# EAGLE design tick-controller-mk-3 (EAGLE 6.5.0)
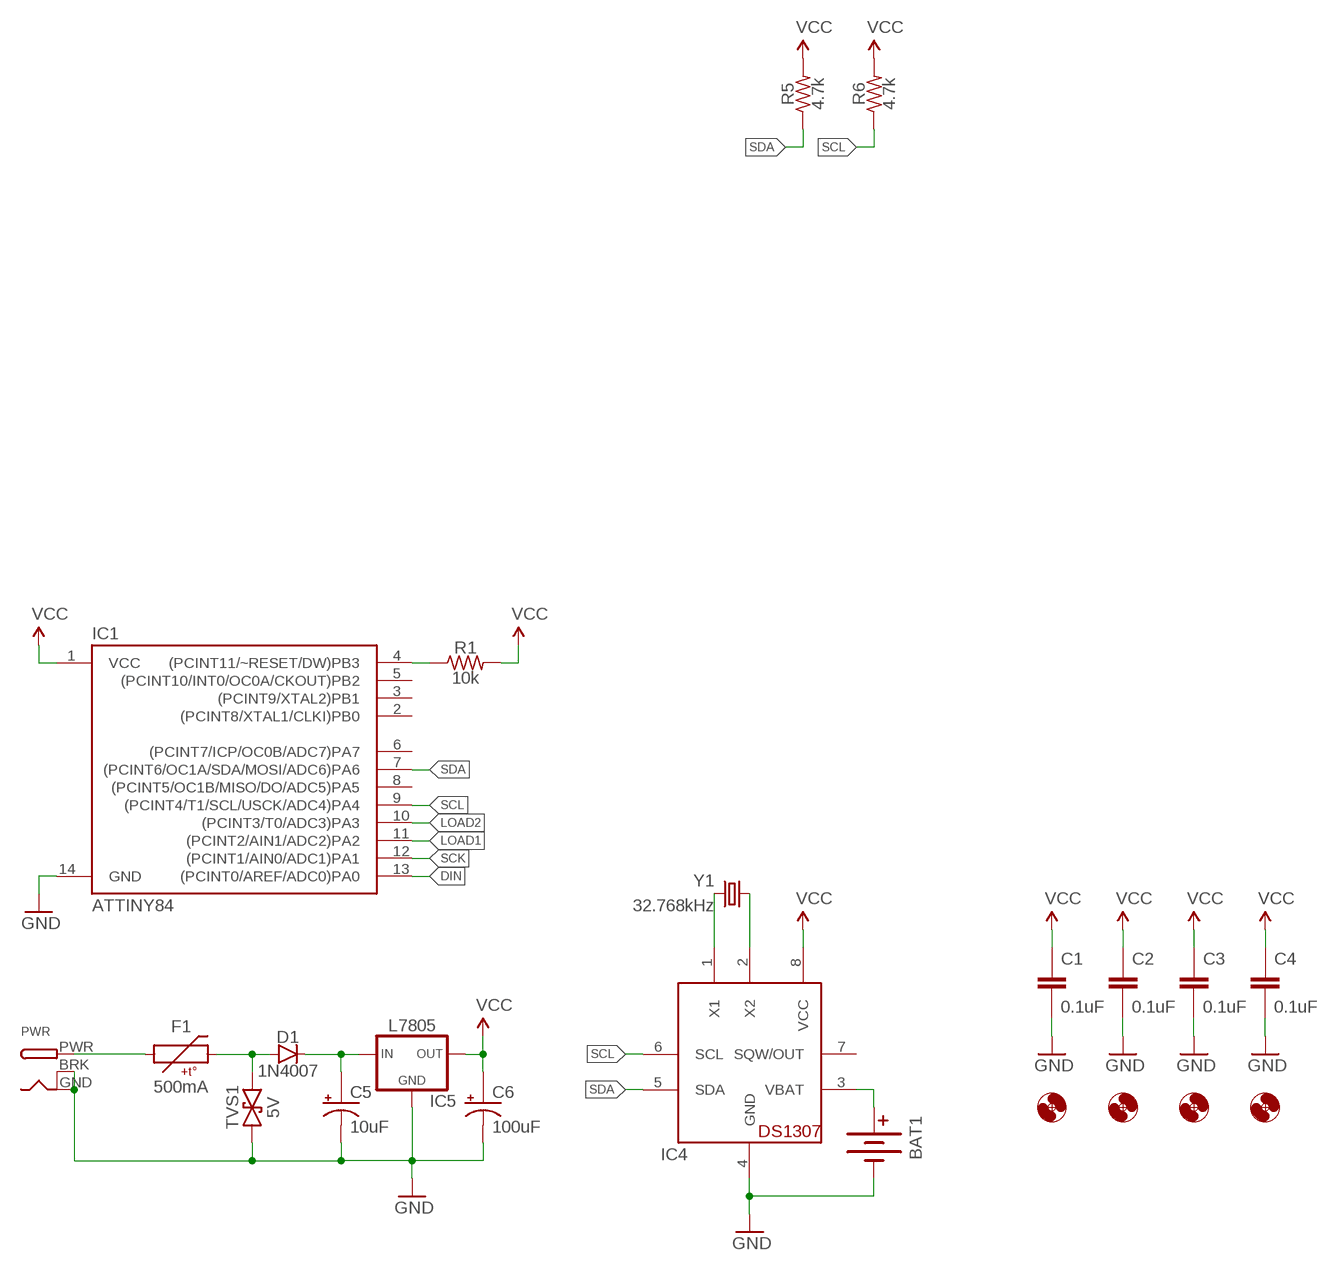
[diagram p0: schematic, sheet 1]

## Parts
BAT1  BATTERY20SMD  [BATTCON_20MM]
C1  0.1uF  CAPACITOR-CERAMIC025-024X044  [C025-024X044]
C2  0.1uF  CAPACITOR-CERAMIC025-024X044  [C025-024X044]
C3  0.1uF  CAPACITOR-CERAMIC025-024X044  [C025-024X044]
C4  0.1uF  CAPACITOR-CERAMIC025-024X044  [C025-024X044]
C5  10uF  CAPACITOR-POLARIZEDE2-5  [E2-5]
C6  100uF  CAPACITOR-POLARIZEDE2-5  [E2-5]
D1  1N4007  DIODEPTH-10.68MM  [DIODE-10.16MM]
F1  500mA  PTCPTH-5.08MM  [PTC-PTH-5.08MM]
H1  HOLE#2  [HOLE-#2]
H2  HOLE#2  [HOLE-#2]
H3  HOLE#2  [HOLE-#2]
H4  HOLE#2  [HOLE-#2]
IC1  ATTINY84  ATTINY84ATTINY84-20PU  [DIL14]
IC4  DS1307  [DIL08]
IC5  L7805  V_REG_78XXTO-92-INLINE  [TO-92-AMMO]
PWR  DCBARRELPTH  [DCJACK_2MM_PTH]
R1  10k  RESISTORPTH-AXIAL-5.08MM  [RESISTOR-AXIAL-PTH-5.08MM]
R5  4.7k  RESISTORPTH-AXIAL-5.08MM  [RESISTOR-AXIAL-PTH-5.08MM]
R6  4.7k  RESISTORPTH-AXIAL-5.08MM  [RESISTOR-AXIAL-PTH-5.08MM]
TVS1  5V  TVSDO-41-10.16MM  [DO-41-TVS-BI-10.16MM]
Y1  32.768kHz  CRYSTALTC26H  [TC26H]

## Nets
DIN: IC1.13((PCINT0/AREF/ADC0)PA0)
GND: BAT1.2(-) C1.2 C2.2 C3.2 C4.2 C5.- C6.- IC1.14(GND) IC4.4(GND) IC5.2(GND) PWR.BRK PWR.GND TVS1.P$1
LOAD1: IC1.11((PCINT2/AIN1/ADC2)PA2)
LOAD2: IC1.10((PCINT3/T0/ADC3)PA3)
N$1: IC1.4((PCINT11/~RESET/DW)PB3) R1.P$1
N$3: IC4.1(X1) Y1.2
N$4: BAT1.1(+) BAT1.3(+) IC4.3(VBAT)
N$5: IC4.2(X2) Y1.1
N$6: C5.+ D1.C IC5.1(IN)
N$7: F1.P$1 PWR.PWR
N$8: D1.A F1.P$2 TVS1.P$2
SCK: IC1.12((PCINT1/AIN0/ADC1)PA1)
SCL: IC1.9((PCINT4/T1/SCL/USCK/ADC4)PA4) IC4.6(SCL) R6.P$1
SDA: IC1.7((PCINT6/OC1A/SDA/MOSI/ADC6)PA6) IC4.5(SDA) R5.P$1
VCC: C1.1 C2.1 C3.1 C4.1 C6.+ IC1.1(VCC) IC4.8(VCC) IC5.3(OUT) R1.P$2 R5.P$2 R6.P$2
Unconnected: IC1.2((PCINT8/XTAL1/CLKI)PB0) IC1.3((PCINT9/XTAL2)PB1) IC1.5((PCINT10/INT0/OC0A/CKOUT)PB2) IC1.6((PCINT7/ICP/OC0B/ADC7)PA7) IC1.8((PCINT5/OC1B/MISO/DO/ADC5)PA5) IC4.7(SQW/OUT)

## Library data of the parts
BAT1 = A_butts:BATTERY: Battery Holders Various common sizes : AA, AAA, 20mm coin cell and 12mm coin cell. 20MM_4LEGS, BATT-10373
C1-C4 = A_butts:CAPACITOR-CERAMIC: CAPACITOR, European symbol
C5 C6 = A_butts:CAPACITOR-POLARIZED: POLARIZED CAPACITOR, American symbol
D1 = A_butts:DIODE: Diode These are standard reverse protection diodes and small signal diodes. SMA package can handle up to about 1A. SOD-323 can handle about 200mA. What the SOD-323 package when ordering, there are some mfgs out there that are 5-pin packages.
F1 = A_butts:PTC: Resettable Fuse PTC Resettable Fuse. Spark Fun Electronics SKU : COM-08357
H1-H4 = A_butts:HOLE: MOUNTING HOLE with drill center marker
IC1 = A_butts:ATTINY84: Atmel 14-pin 2/4/8kB flash uC
IC4 = A_butts:DS1307: DS1307 Real time clock (RTC) with battery backup ability. Talk to it via i2c
IC5 = A_butts:V_REG_78XX: Voltage Regulator Standard 7805 5V regulator. IGO (Input Ground Output). Spark Fun Electronics SKU : COM-00107
PWR = A_butts:DCBARREL: 2.0mm DC Barrel Jack DCJACK_2MM_PTH - Through Hole Jack (4UConnector: 05537)
R1 R5 R6 = A_butts:RESISTOR: RESISTOR, American symbol
TVS1 = A_butts:TVS: Transient voltage suppressor- prevents ESD on inputs. Ignore package description- MBRA140 is NOT this type of part!!!
Y1 = A_butts:CRYSTAL: Various standard crystals. Proven footprints. Spark Fun Electronics SKU : COM-00534

## Board
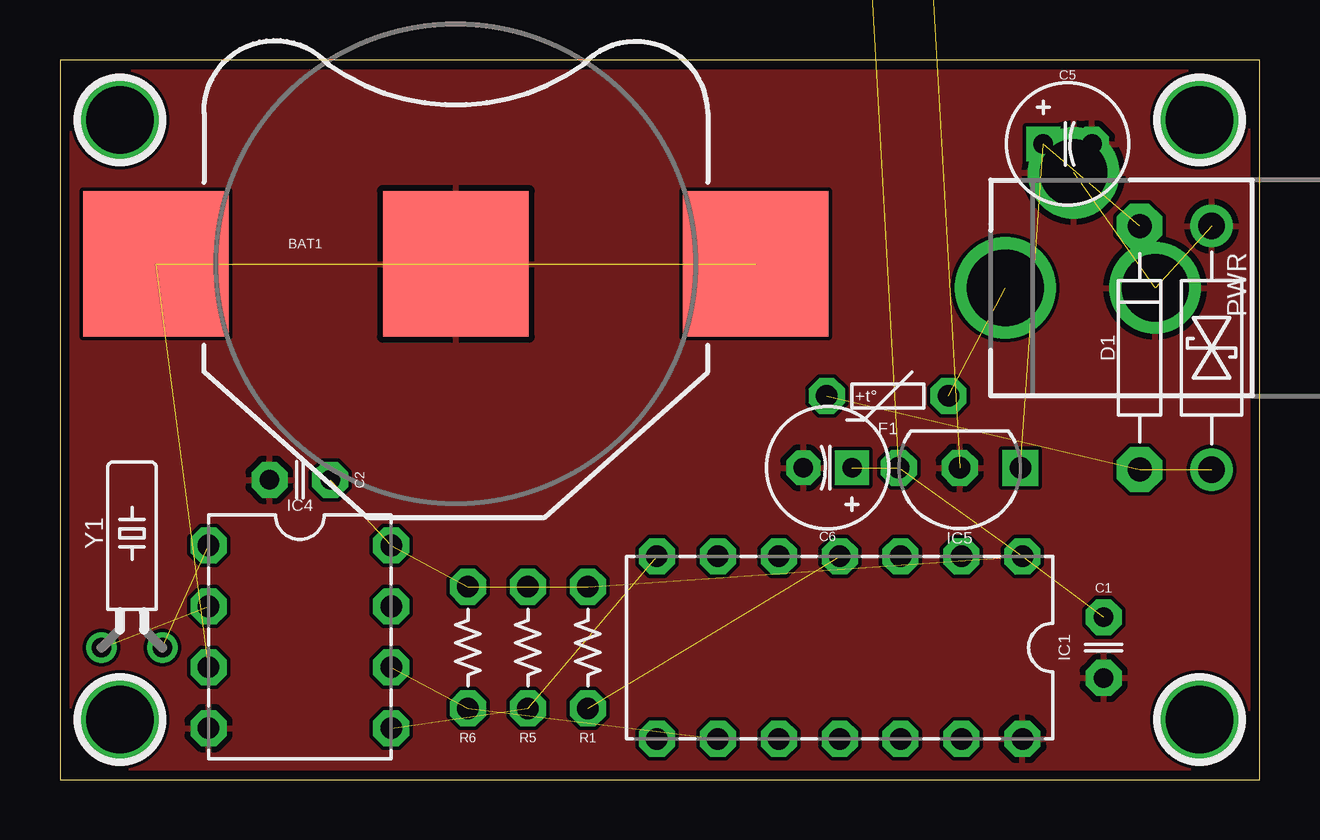
[diagram p1: board, top side]
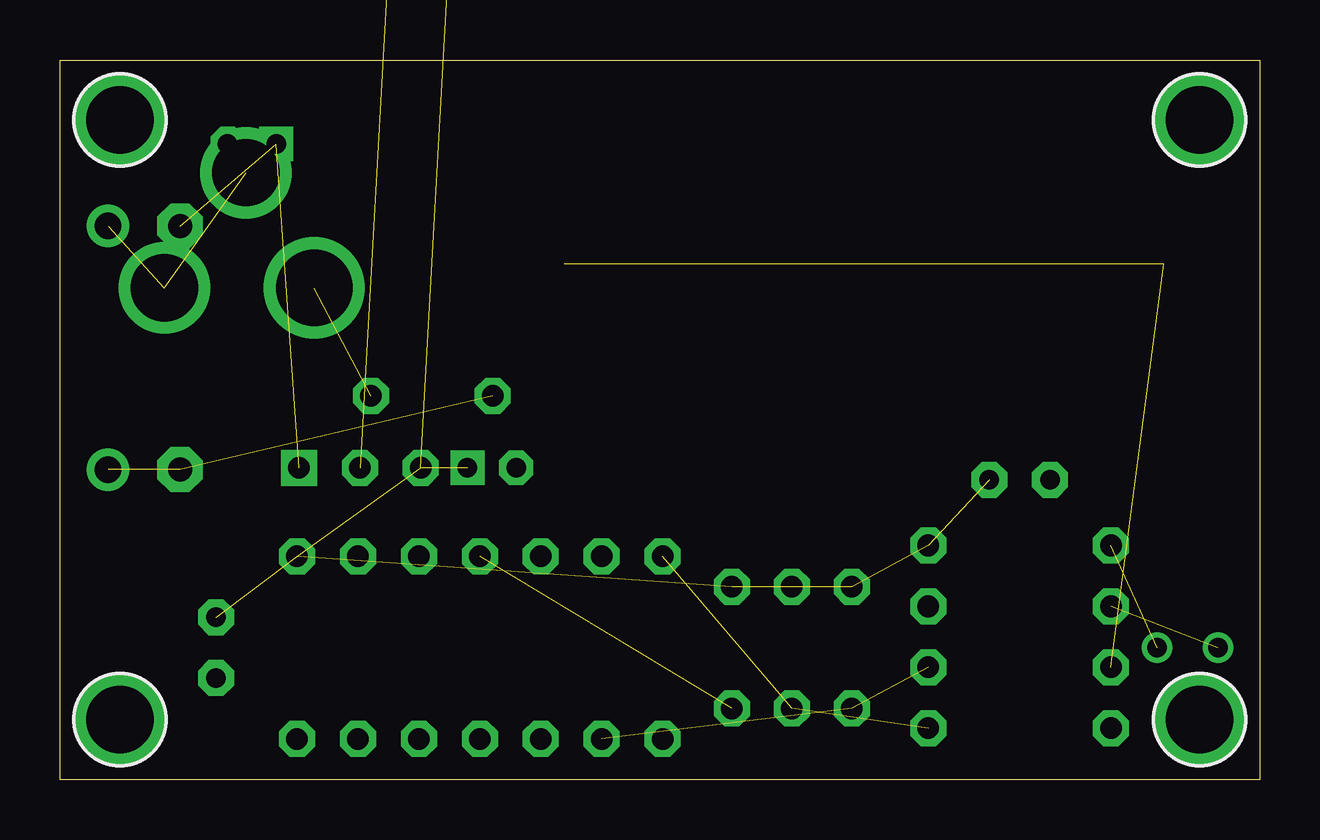
[diagram p2: board, bottom side, seen from below]

Size 50 x 30 mm. Coordinates in mm from the lower left corner, seen from the top.
Outline: 0,0 50,0 50,30 0,30 0,0
Copper layers (1*16): Top 0.0356mm / dielectric 1.5011mm / Bottom 0.0356mm
Design rules "LaenPCBOrder2": minimum track width 6mil, minimum drill 13mil, track to track 6mil, track to pad 6mil, pad to pad 6mil, via to via 6mil, smd to smd 6mil, copper to edge 15mil, drill to drill 6mil, minimum pad ring 7mil, minimum via ring 7mil, stop-mask expansion 3mil, vias tented up to drill 20mil, thermal gap 10mil

### Footprints (pad centres in the part's own frame; a part is rotated, then mirrored left to right if it is on the bottom)
BATTCON_20MM = smd 6.07 x 6.07: 1 -12.5,0; 2 0,0; 3 12.5,0
C025-024X044 = drill 0.813 pad 1.5 octagon: 1 -1.27,0; 2 1.27,0
E2-5 = drill 0.813 pad 1.422 square: + -1.016,0 | drill 0.813 pad 1.422 octagon: - 1.016,0
DIODE-10.16MM = drill 1 pad 1.88 octagon: A -5.08,0; C 5.08,0
PTC-PTH-5.08MM = drill 0.9 pad 1.5 octagon: P$1 -2.54,0; P$2 2.54,0
HOLE-#2 = drill 2.8 pad 3.81: P$1 0,0
DIL14 = drill 0.9 pad 1.5 octagon: 1 -7.62,-3.81; 2 -5.08,-3.81; 3 -2.54,-3.81; 4 0,-3.81; 5 2.54,-3.81; 6 5.08,-3.81; 7 7.62,-3.81; 8 7.62,3.81; 9 5.08,3.81; 10 2.54,3.81; 11 0,3.81; 12 -2.54,3.81; 13 -5.08,3.81; 14 -7.62,3.81
DIL08 = drill 0.9 pad 1.5 octagon: 1 -3.81,-3.81; 2 -1.27,-3.81; 3 1.27,-3.81; 4 3.81,-3.81; 5 3.81,3.81; 6 1.27,3.81; 7 -1.27,3.81; 8 -3.81,3.81
TO-92-AMMO = drill 0.9 pad 1.5 square: 1 -2.54,0 | drill 0.9 pad 1.5 octagon: 2 0,0; 3 2.54,0
DCJACK_2MM_PTH = drill 2.8: BRK 4.8,10.75; GND 0,7.35 | drill 3.2: PWR 0,13.6
RESISTOR-AXIAL-PTH-5.08MM = drill 0.9 pad 1.5 octagon: P$1 -2.54,0; P$2 2.54,0
DO-41-TVS-BI-10.16MM = drill 1.1 pad 1.778: P$1 -5.08,0; P$2 5.08,0
TC26H = drill 0.8 pad 1.27: 1 -1.27,0; 2 1.27,0

### Placement (x,y rotation side)
BAT1  16.5,21.5 0 top
C1  43.5,5.5 270 top
C2  10,12.5 180 top
C3  35,35 0 top  (outside the outline)
C4  29,35 180 top  (outside the outline)
C5  42,26.5 0 top
C6  32,13 180 top
D1  45,18 90 top
F1  34.5,16 180 top
H1  2.5,2.5 0 top
H2  2.5,27.5 0 top
H3  47.5,2.5 0 top
H4  47.5,27.5 0 top
IC1  32.5,5.5 180 top
IC4  10,5.95 270 top
IC5  37.5,13 180 top
PWR  53,20.5 90 top
R1  22,5.5 90 top
R5  19.5,5.5 90 top
R6  17,5.5 90 top
TVS1  48,18 270 top
Y1  3,5.5 0 top

### Tracks (layer width: path | path; a pad name or v marks a point on that pad's centre or on a via)
GND  (4 unrouted)
  pour Top: 0,0 0,30 50,30 50,0
N$1  (1 unrouted)
N$3  (1 unrouted)
N$4  (2 unrouted)
N$5  (1 unrouted)
N$6  (2 unrouted)
N$7  (1 unrouted)
N$8  (2 unrouted)
SCL  (2 unrouted)
SDA  (2 unrouted)
VCC  (10 unrouted)